# Altium project S88N_Occupancy_Detector.PrjPcb
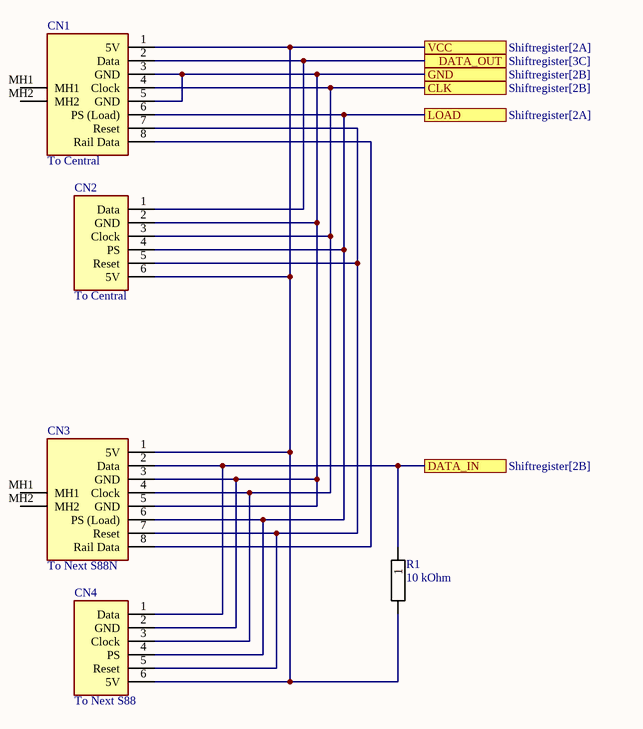
[diagram p0: Databus.SchDoc]
6 sheets, 55 parts. Net scope: flat (ports and power ports of the same name join across sheets).
Board files: S88N_Occupancy_Detector.PcbDoc, S88N_Occupancy_Detector_Rev_2.PcbDoc
Sheets:
  Databus.SchDoc
  Shiftregister.SchDoc
  Inverter.SchDoc
  Current_Detection_Connectors.SchDoc
  Current_Detection_1_8.SchDoc
  Current_Detection_9_16.SchDoc

## Sheet Databus.SchDoc: S88-N Occupancy Detector
size A4; DrawnBy: Sem Kirkels; DocumentNumber: 23P001S01; Revision: V1; SheetNumber: 1; SheetTotal: 6

### Parts
CN1  To Central  [RJ45_Connector]
CN2  To Central  [6 pin header]
CN3  To Next S88N  [RJ45_Connector]
CN4  To Next S88  [6 pin header]
R1  10 kOhm  [1N4007]

### Ports
CLK (see Shiftregister[2B]), DATA_IN (see Shiftregister[2B]), DATA_OUT (see Shiftregister[3C]), GND (see Shiftregister[2B]), LOAD (see Shiftregister[2A]), VCC (see Shiftregister[2A])

### Nets
GND: CN1.3(GND) CN1.5(GND) CN2.2(GND) CN3.3(GND) CN3.5(GND) CN4.2(GND) ; port GND
VCC: CN1.1(5V) CN2.6(5V) CN3.1(5V) CN4.6(5V) R1.2 ; port VCC
NetCN1_2: CN1.2(Data) CN2.1(Data) ; port DATA_OUT
NetCN1_4: CN1.4(Clock) CN2.3(Clock) CN3.4(Clock) CN4.3(Clock) ; port CLK
NetCN1_6: CN1.6(PS_(Load)) CN2.4(PS) CN3.6(PS_(Load)) CN4.4(PS) ; port LOAD
NetCN1_7: CN1.7(Reset) CN2.5(Reset) CN3.7(Reset) CN4.5(Reset)
NetCN1_8: CN1.8(Rail_Data) CN3.8(Rail_Data)
NetCN3_2: CN3.2(Data) CN4.1(Data) R1.1 ; port DATA_IN

Not connected (* = marked no-connect by the designer): CN1 MH1 MH2; CN3 MH1 MH2

### Library data of the parts
CN1 CN3 = RJ45_Connector: Connector; Manufacturer_Name: Weidmuller; Manufacturer_Part_Number: 2562910000; Datasheet Link: https://catalog.weidmueller.com/catalog/Start.do?localeId=en&ObjectID=2562910000; Height: 13.76mm; Mouser Part Number: 470-2562910000; Mouser Price/Stock: https://www.mouser.co.uk/ProductDetail/Weidmuller/2562910000?qs=w%2Fv1CP2dgqr4xNEXLArdDQ%3D%3D
CN2 CN4 = 6 pin header: 78511-406; Manufacturer_Name: Amphenol Communication Solutions; Datasheet Link: https://cdn.amphenol-cs.com/media/wysiwyg/files/drawing/68000.pdf; Height: 10.62mm; Manufacturer_Part_Number: 78511-406; Mouser Part Number: 649-78511-406; Mouser Price/Stock: https://www.mouser.co.uk/ProductDetail/Amphenol-FCI/78511-406?qs=44C8ns5dLY9MkbPan6dMVA%3D%3D; Arrow Part Number: 78511-406; Arrow Price/Stock: https://www.arrow.com/en/products/78511-406/amphenol-fci
R1 = Resistor: NexarPartId: 43026420; Power Rating: 3W; Tolerance: 5%; Temperature Coefficient: -10ppm/°C; Resistance: 8.2Ω; Thickness: 4.8006mm; Radiation Hardening: No; Min Operating Temperature: -40°C; Case/Package: Axial; Packaging: Tape & Box (TB); Termination: Axial; Width: 4.8006mm; Military Standard: Not; Diameter: 4.8mm; RoHS: Compliant; Contact Plating: Tin; Composition: Wirewound; Features: Flame Retardant Coating; Number of Terminations: 2; Length: 13mm; Max Power Dissipation: 3W; Mount: Through Hole; Max Operating Temperature: 200°C

## Sheet Shiftregister.SchDoc: S88-N Occupancy Detector
size A4; DrawnBy: Sem Kirkels; DocumentNumber: 23P001S02; Revision: V1; SheetNumber: 2; SheetTotal: 6
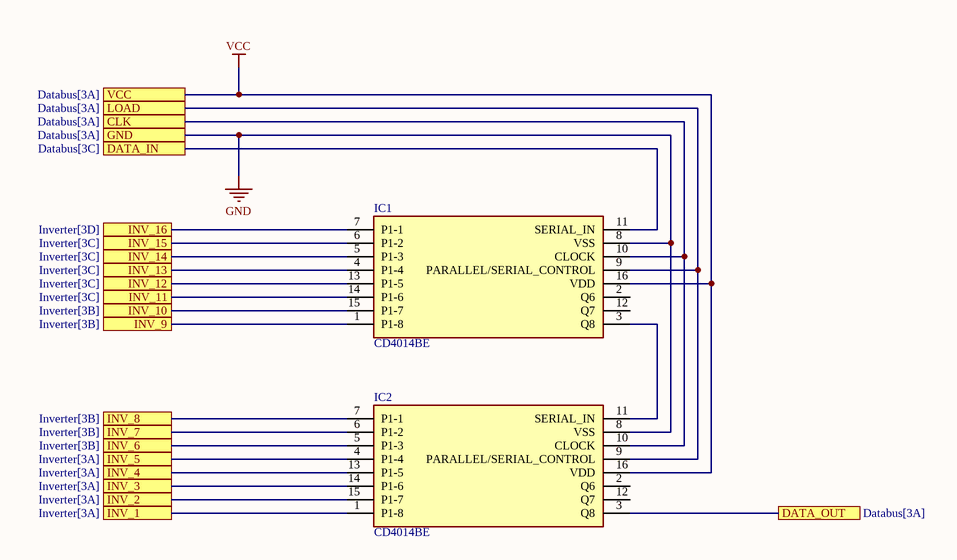
[diagram p1: Shiftregister.SchDoc]

### Parts
IC1  CD4014BE  [CD4014]
IC2  CD4014BE  [CD4014]

### Ports
CLK (see Databus[3A]), DATA_IN (see Databus[3C]), DATA_OUT (see Databus[3A]), GND (see Databus[3A]), INV_1 (see Inverter[3A]), INV_2 (see Inverter[3A]), INV_3 (see Inverter[3A]), INV_4 (see Inverter[3A]), INV_5 (see Inverter[3A]), INV_6 (see Inverter[3B]), INV_7 (see Inverter[3B]), INV_8 (see Inverter[3B]), INV_9 (see Inverter[3B]), INV_10 (see Inverter[3B]), INV_11 (see Inverter[3C]), INV_12 (see Inverter[3C]), INV_13 (see Inverter[3C]), INV_14 (see Inverter[3C]), INV_15 (see Inverter[3C]), INV_16 (see Inverter[3D]), LOAD (see Databus[3A]), VCC (see Databus[3A])

### Nets
GND: IC1.8(VSS) IC2.8(VSS) ; port GND
VCC: IC1.16(VDD) IC2.16(VDD) ; port VCC
NetCN1_2: IC2.3(Q8) ; port DATA_OUT
NetCN1_4: IC1.10(CLOCK) IC2.10(CLOCK) ; port CLK
NetCN1_6: IC1.9(PARALLEL/SERIAL_CONTROL) IC2.9(PARALLEL/SERIAL_CONTROL) ; port LOAD
NetCN3_2: IC1.11(SERIAL_IN) ; port DATA_IN
NetIC1_1: IC1.1(P1-8) ; port INV_9
NetIC1_3: IC1.3(Q8) IC2.11(SERIAL_IN)
NetIC1_4: IC1.4(P1-4) ; port INV_13
NetIC1_5: IC1.5(P1-3) ; port INV_14
NetIC1_6: IC1.6(P1-2) ; port INV_15
NetIC1_7: IC1.7(P1-1) ; port INV_16
NetIC1_13: IC1.13(P1-5) ; port INV_12
NetIC1_14: IC1.14(P1-6) ; port INV_11
NetIC1_15: IC1.15(P1-7) ; port INV_10
NetIC2_1: IC2.1(P1-8) ; port INV_1
NetIC2_4: IC2.4(P1-4) ; port INV_5
NetIC2_5: IC2.5(P1-3) ; port INV_6
NetIC2_6: IC2.6(P1-2) ; port INV_7
NetIC2_7: IC2.7(P1-1) ; port INV_8
NetIC2_13: IC2.13(P1-5) ; port INV_4
NetIC2_14: IC2.14(P1-6) ; port INV_3
NetIC2_15: IC2.15(P1-7) ; port INV_2

Not connected (* = marked no-connect by the designer): IC1 2(Q6) 12(Q7); IC2 2(Q6) 12(Q7)

### Library data of the parts
IC1 IC2 = CD4014BE: Integrated Circuit; Manufacturer_Name: Texas Instruments; Datasheet Link: http://www.ti.com/lit/gpn/cd4014b; Height: 5.08mm; Manufacturer_Part_Number: CD4014BE; Mouser Part Number: 595-CD4014BE; Mouser Price/Stock: https://www.mouser.co.uk/ProductDetail/Texas-Instruments/CD4014BE?qs=8k%2FZSzWMuCOtKecuorM4CQ%3D%3D; Arrow Part Number: CD4014BE; Arrow Price/Stock: https://www.arrow.com/en/products/cd4014be/texas-instruments?region=nac

## Sheet Inverter.SchDoc: S88-N Occupancy Detector
size A4; DrawnBy: Sem Kirkels; DocumentNumber: 23P001S03; Revision: V2; SheetNumber: 3; SheetTotal: 6
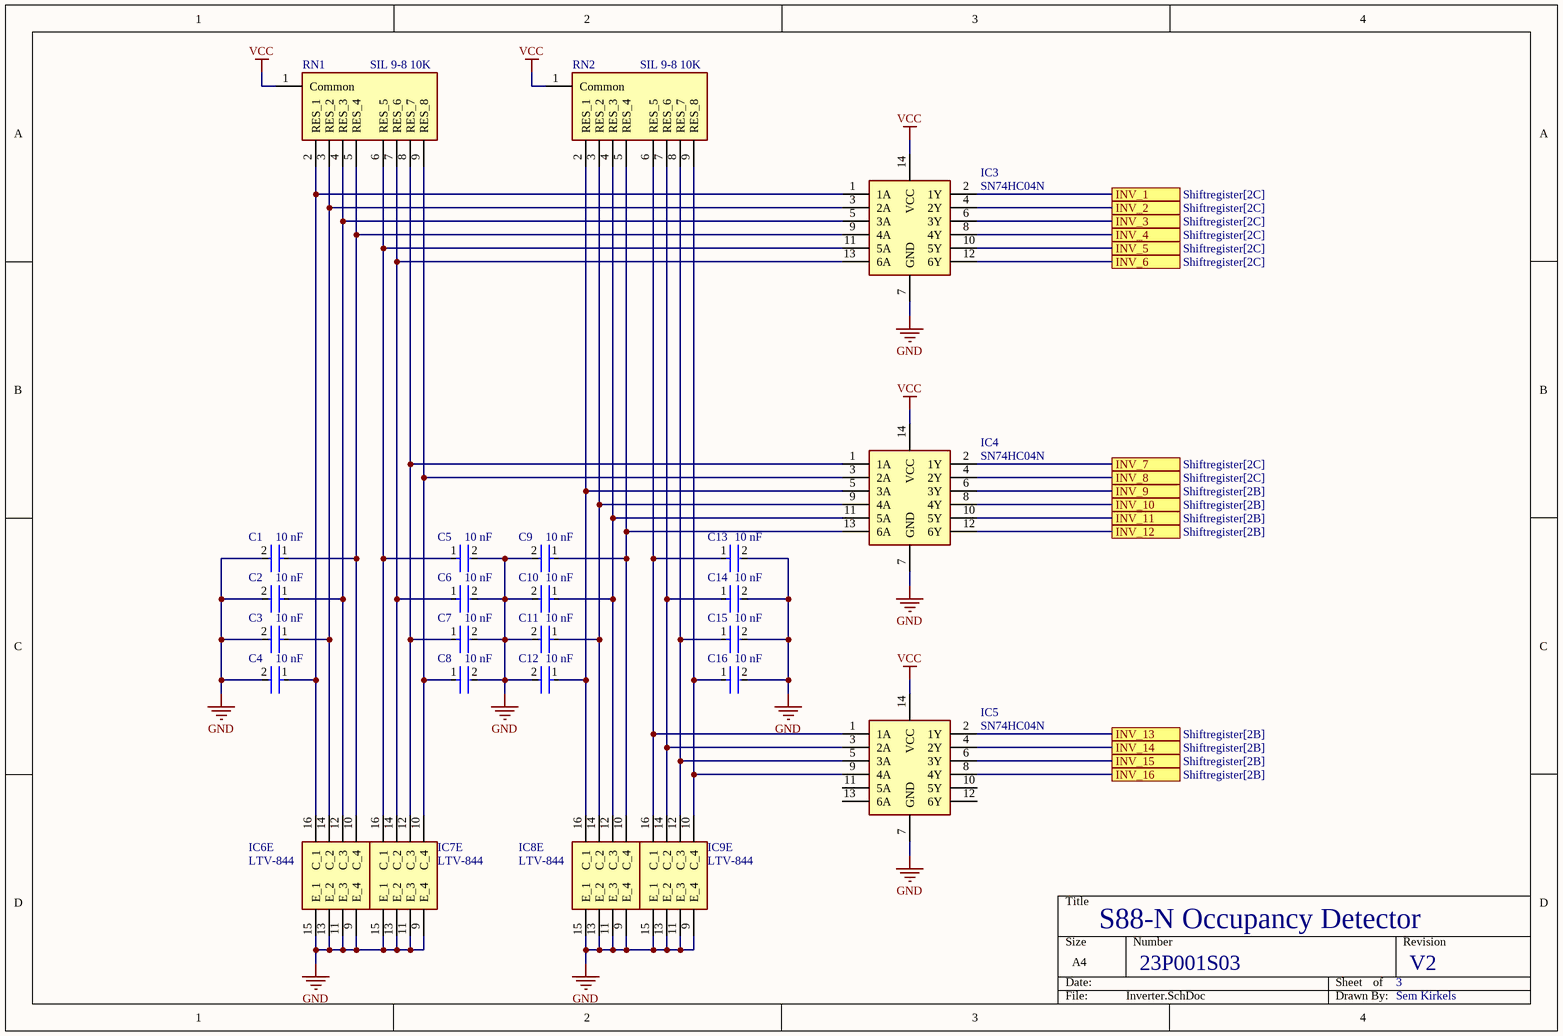
[diagram p2: Inverter.SchDoc]

### Parts
C1  10 nF  [Capacitor]
C2  10 nF  [Capacitor]
C3  10 nF  [Capacitor]
C4  10 nF  [Capacitor]
C5  10 nF  [Capacitor]
C6  10 nF  [Capacitor]
C7  10 nF  [Capacitor]
C8  10 nF  [Capacitor]
C9  10 nF  [Capacitor]
C10  10 nF  [Capacitor]
C11  10 nF  [Capacitor]
C12  10 nF  [Capacitor]
C13  10 nF  [Capacitor]
C14  10 nF  [Capacitor]
C15  10 nF  [Capacitor]
C16  10 nF  [Capacitor]
IC3  SN74HC04N  [SN74HC04]
IC4  SN74HC04N  [SN74HC04]
IC5  SN74HC04N  [SN74HC04]
IC6  LTV-844  [CD4014]  (part E of 5)
IC7  LTV-844  [CD4014]  (part E of 5)
IC8  LTV-844  [CD4014]  (part E of 5)
IC9  LTV-844  [CD4014]  (part E of 5)
RN1  SIL 9-8 10K  [SIL 9-8 10K]
RN2  SIL 9-8 10K  [SIL 9-8 10K]

### Ports
INV_1 (see Shiftregister[2C]), INV_2 (see Shiftregister[2C]), INV_3 (see Shiftregister[2C]), INV_4 (see Shiftregister[2C]), INV_5 (see Shiftregister[2C]), INV_6 (see Shiftregister[2C]), INV_7 (see Shiftregister[2C]), INV_8 (see Shiftregister[2C]), INV_9 (see Shiftregister[2B]), INV_10 (see Shiftregister[2B]), INV_11 (see Shiftregister[2B]), INV_12 (see Shiftregister[2B]), INV_13 (see Shiftregister[2B]), INV_14 (see Shiftregister[2B]), INV_15 (see Shiftregister[2B]), INV_16 (see Shiftregister[2B])

### Nets
GND: C1.2 C2.2 C3.2 C4.2 C5.2 C6.2 C7.2 C8.2 C9.2 C10.2 C11.2 C12.2 C13.2 C14.2 C15.2 C16.2 IC3.7(GND) IC4.7(GND) IC5.7(GND) IC6.9(E_4) IC6.11(E_3) IC6.13(E_2) IC6.15(E_1) IC7.9(E_4) IC7.11(E_3) IC7.13(E_2) IC7.15(E_1) IC8.9(E_4) IC8.11(E_3) IC8.13(E_2) IC8.15(E_1) IC9.9(E_4) IC9.11(E_3) IC9.13(E_2) IC9.15(E_1)
VCC: IC3.14(VCC) IC4.14(VCC) IC5.14(VCC) RN1.1(Common) RN2.1(Common)
NetC1_1: C1.1 IC3.9(4A) IC6.10(C_4) RN1.5(RES_4)
NetC2_1: C2.1 IC3.5(3A) IC6.12(C_3) RN1.4(RES_3)
NetC3_1: C3.1 IC3.3(2A) IC6.14(C_2) RN1.3(RES_2)
NetC4_1: C4.1 IC3.1(1A) IC6.16(C_1) RN1.2(RES_1)
NetC5_1: C5.1 IC3.11(5A) IC7.16(C_1) RN1.6(RES_5)
NetC6_1: C6.1 IC3.13(6A) IC7.14(C_2) RN1.7(RES_6)
NetC7_1: C7.1 IC4.1(1A) IC7.12(C_3) RN1.8(RES_7)
NetC8_1: C8.1 IC4.3(2A) IC7.10(C_4) RN1.9(RES_8)
NetC9_1: C9.1 IC4.13(6A) IC8.10(C_4) RN2.5(RES_4)
NetC10_1: C10.1 IC4.11(5A) IC8.12(C_3) RN2.4(RES_3)
NetC11_1: C11.1 IC4.9(4A) IC8.14(C_2) RN2.3(RES_2)
NetC12_1: C12.1 IC4.5(3A) IC8.16(C_1) RN2.2(RES_1)
NetC13_1: C13.1 IC5.1(1A) IC9.16(C_1) RN2.6(RES_5)
NetC14_1: C14.1 IC5.3(2A) IC9.14(C_2) RN2.7(RES_6)
NetC15_1: C15.1 IC5.5(3A) IC9.12(C_3) RN2.8(RES_7)
NetC16_1: C16.1 IC5.9(4A) IC9.10(C_4) RN2.9(RES_8)
NetIC1_1: IC4.6(3Y) ; port INV_9
NetIC1_4: IC5.2(1Y) ; port INV_13
NetIC1_5: IC5.4(2Y) ; port INV_14
NetIC1_6: IC5.6(3Y) ; port INV_15
NetIC1_7: IC5.8(4Y) ; port INV_16
NetIC1_13: IC4.12(6Y) ; port INV_12
NetIC1_14: IC4.10(5Y) ; port INV_11
NetIC1_15: IC4.8(4Y) ; port INV_10
NetIC2_1: IC3.2(1Y) ; port INV_1
NetIC2_4: IC3.10(5Y) ; port INV_5
NetIC2_5: IC3.12(6Y) ; port INV_6
NetIC2_6: IC4.2(1Y) ; port INV_7
NetIC2_7: IC4.4(2Y) ; port INV_8
NetIC2_13: IC3.8(4Y) ; port INV_4
NetIC2_14: IC3.6(3Y) ; port INV_3
NetIC2_15: IC3.4(2Y) ; port INV_2

Not connected (* = marked no-connect by the designer): IC5 10(5Y) 11(5A) 12(6Y) 13(6A)

### Library data of the parts
C1-C16 = Capacitor: Voltage Rating (AC): 500V; Lead Diameter: 0.6mm; Capacitance: 4.7nF; Tolerance: 20%; Lead/Base Style: Kinked; Dielectric: Y5U; Termination: Radial; Resistor Type: Ceramic; Radiation Hardening: No; Diameter: 16mm; Max Operating Temperature: 125°C; Case/Package: Radial; Thickness: 5mm; Lead Pitch: 10mm; Series: VY1; Contact Plating: Tin; Depth: 5mm; RoHS Compliant: Yes; Voltage: 500V; Voltage Rating (DC): 500V; Package Quantity: 500; Construction: RADIAL; Min Operating Temperature: -40°C; Height: 19mm; Height - Seated (Max): 0.787inch; Packaging: Tape and Reel; Mount: Through Hole
IC3-IC5 = SN74HC04N: Integrated Circuit; Manufacturer_Name: Texas Instruments; Datasheet Link: http://www.ti.com/lit/gpn/sn74hc04; Height: 5.08mm; Manufacturer_Part_Number: SN74HC04N; Mouser Part Number: 595-SN74HC04N; Mouser Price/Stock: https://www.mouser.co.uk/ProductDetail/Texas-Instruments/SN74HC04N?qs=L5CvrNUdZirrSGYiJvTylA%3D%3D; Arrow Part Number: SN74HC04N; Arrow Price/Stock: https://www.arrow.com/en/products/sn74hc04n/texas-instruments?region=nac
IC6-IC9 = LTV-844: Integrated Circuit; Manufacturer_Name: Lite-On; Datasheet Link: https://componentsearchengine.com/Datasheets/1/LTV-844.pdf; Height: 4.5mm; Manufacturer_Part_Number: LTV-844; Mouser Part Number: 859-LTV-844; Mouser Price/Stock: https://www.mouser.co.uk/ProductDetail/Lite-On/LTV-844?qs=BZ0sscl82p8P4kyBjSwzAg%3D%3D; Arrow Part Number: LTV-844; Arrow Price/Stock: https://www.arrow.com/en/products/ltv-844/lite-on-technology?region=nac
RN1 RN2 = SIL 9-8 10K: CSC09A0110K0GEK; Manufacturer_Name: Vishay; Datasheet Link: https://www.vishay.com/docs/31509/csc.pdf; Height: 4.95mm; Manufacturer_Part_Number: CSC09A0110K0GEK; Mouser Part Number: 71-CSC09A0110K0GEK; Mouser Price/Stock: https://www.mouser.co.uk/ProductDetail/Vishay-Dale/CSC09A0110K0GEK?qs=Jzz%252BfO4IBMfusae2i1IhQQ%3D%3D; Arrow Part Number: CSC09A0110K0GEK; Arrow Price/Stock: https://www.arrow.com/en/products/csc09a0110k0gek/vishay

## Sheet Current_Detection_Connectors.SchDoc: S88-N Occupancy Detector
size A4; DrawnBy: Sem Kirkels; DocumentNumber: 23P001S04; Revision: V1; SheetNumber: 4; SheetTotal: 6
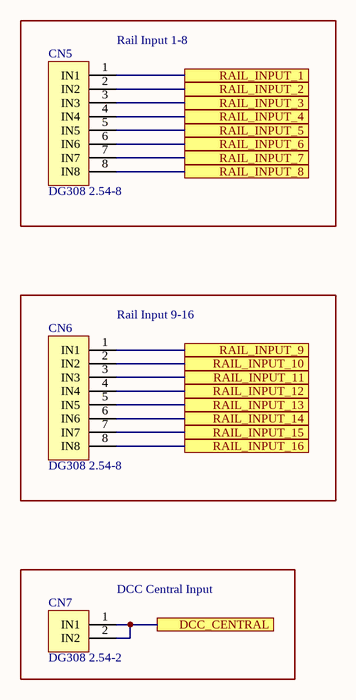
[diagram p3: Current_Detection_Connectors.SchDoc]

### Parts
CN5  DG308 2.54-8  [DG308 2.54-8]
CN6  DG308 2.54-8  [DG308 2.54-8]
CN7  DG308 2.54-2  [DG308 2.54-2]

### Blocks framed on the sheet
Rail Input 1-8: CN5
Rail Input 9-16: CN6
DCC Central Input: CN7

### Ports
DCC_CENTRAL (see Current_Detection_1_8[2A], Current_Detection_1_8[2B], Current_Detection_1_8[2C], Current_Detection_1_8[4A], Current_Detection_1_8[4B], Current_Detection_1_8[4C], Current_Detection_9_16[2A], Current_Detection_9_16[2B], Current_Detection_9_16[2C], Current_Detection_9_16[4A], Current_Detection_9_16[4B], Current_Detection_9_16[4C]), RAIL_INPUT_1 (see Current_Detection_1_8[1A]), RAIL_INPUT_2 (see Current_Detection_1_8[3A]), RAIL_INPUT_3 (see Current_Detection_1_8[1B]), RAIL_INPUT_4 (see Current_Detection_1_8[3B]), RAIL_INPUT_5 (see Current_Detection_1_8[1B]), RAIL_INPUT_6 (see Current_Detection_1_8[3B]), RAIL_INPUT_7 (see Current_Detection_1_8[1C]), RAIL_INPUT_8 (see Current_Detection_1_8[3C]), RAIL_INPUT_9 (see Current_Detection_9_16[1A]), RAIL_INPUT_10 (see Current_Detection_9_16[3A]), RAIL_INPUT_11 (see Current_Detection_9_16[1B]), RAIL_INPUT_12 (see Current_Detection_9_16[3B]), RAIL_INPUT_13 (see Current_Detection_9_16[1B]), RAIL_INPUT_14 (see Current_Detection_9_16[3B]), RAIL_INPUT_15 (see Current_Detection_9_16[1C]), RAIL_INPUT_16 (see Current_Detection_9_16[3C])

### Nets
NetCN5_1: CN5.1(IN1) ; port RAIL_INPUT_1
NetCN5_2: CN5.2(IN2) ; port RAIL_INPUT_2
NetCN5_3: CN5.3(IN3) ; port RAIL_INPUT_3
NetCN5_4: CN5.4(IN4) ; port RAIL_INPUT_4
NetCN5_5: CN5.5(IN5) ; port RAIL_INPUT_5
NetCN5_6: CN5.6(IN6) ; port RAIL_INPUT_6
NetCN5_7: CN5.7(IN7) ; port RAIL_INPUT_7
NetCN5_8: CN5.8(IN8) ; port RAIL_INPUT_8
NetCN6_1: CN6.1(IN1) ; port RAIL_INPUT_9
NetCN6_2: CN6.2(IN2) ; port RAIL_INPUT_10
NetCN6_3: CN6.3(IN3) ; port RAIL_INPUT_11
NetCN6_4: CN6.4(IN4) ; port RAIL_INPUT_12
NetCN6_5: CN6.5(IN5) ; port RAIL_INPUT_13
NetCN6_6: CN6.6(IN6) ; port RAIL_INPUT_14
NetCN6_7: CN6.7(IN7) ; port RAIL_INPUT_15
NetCN6_8: CN6.8(IN8) ; port RAIL_INPUT_16
NetCN7_1: CN7.1(IN1) CN7.2(IN2) ; port DCC_CENTRAL

### Library data of the parts
CN5 CN6 = 8_Pin_Screw_Connector
CN7 = 2_Pin_Screw_Connector

## Sheet Current_Detection_1_8.SchDoc: S88-N Occupancy Detector
size A4; DrawnBy: Sem Kirkels; DocumentNumber: 23P001S05; Revision: V1; SheetNumber: 5; SheetTotal: 6
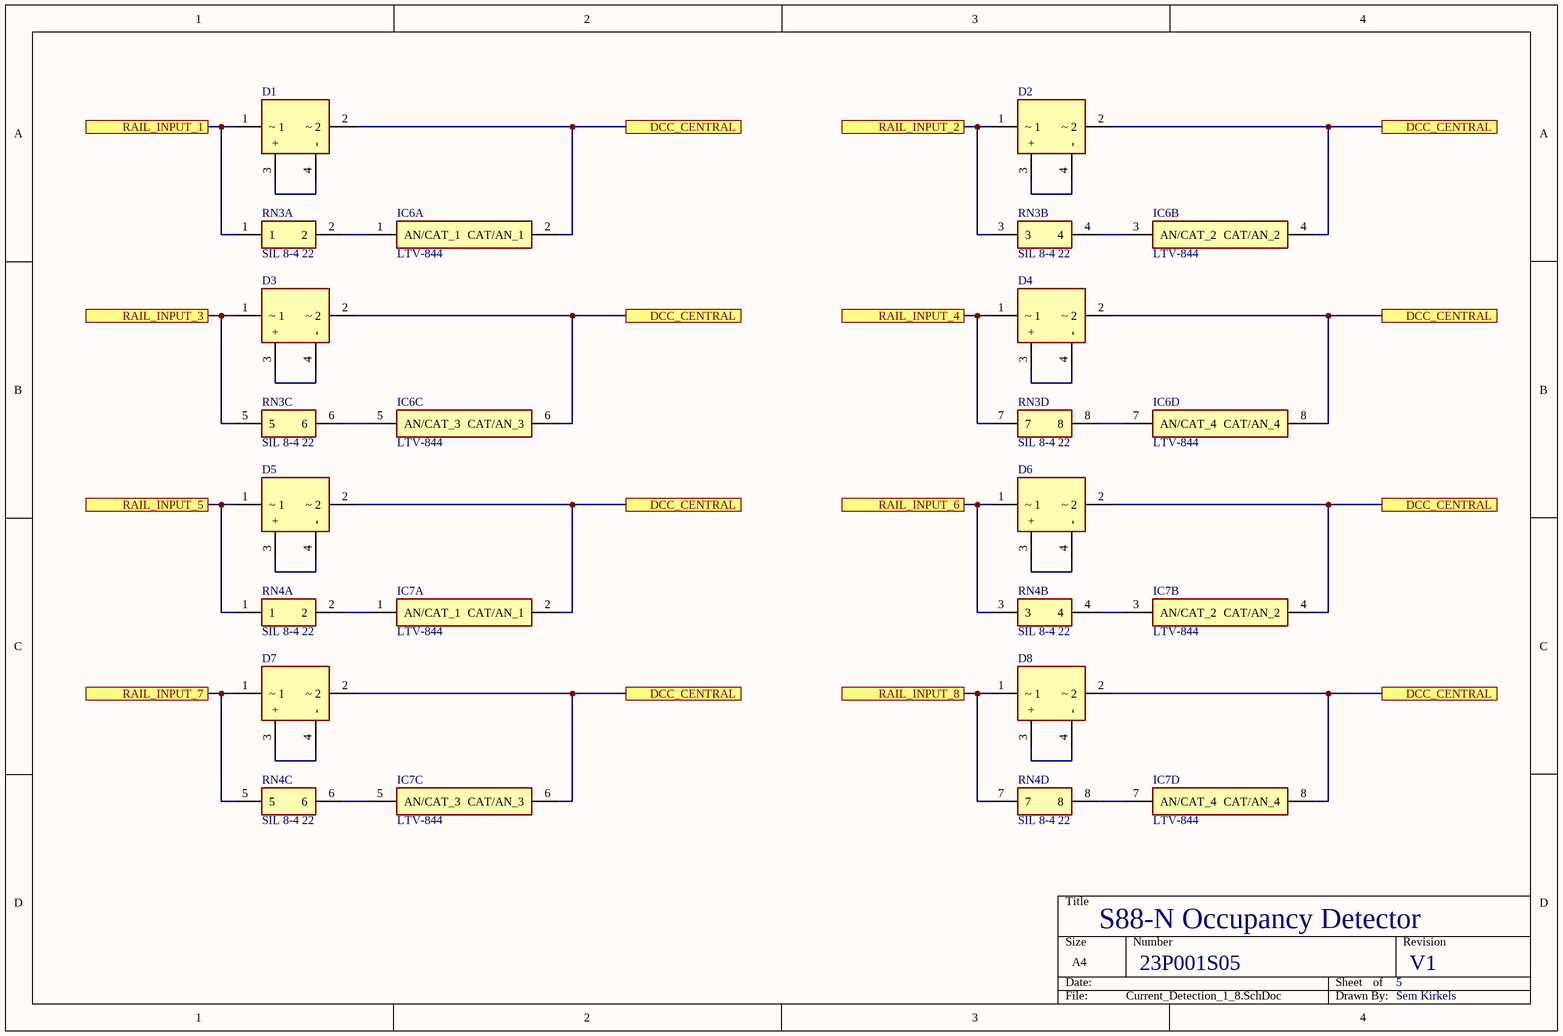
[diagram p4: Current_Detection_1_8.SchDoc]

### Parts
D1  B140C1000DIP_DB101  [FBR_B140C1000DIP]  (value not drawn)
D2  B140C1000DIP_DB101  [FBR_B140C1000DIP]  (value not drawn)
D3  B140C1000DIP_DB101  [FBR_B140C1000DIP]  (value not drawn)
D4  B140C1000DIP_DB101  [FBR_B140C1000DIP]  (value not drawn)
D5  B140C1000DIP_DB101  [FBR_B140C1000DIP]  (value not drawn)
D6  B140C1000DIP_DB101  [FBR_B140C1000DIP]  (value not drawn)
D7  B140C1000DIP_DB101  [FBR_B140C1000DIP]  (value not drawn)
D8  B140C1000DIP_DB101  [FBR_B140C1000DIP]  (value not drawn)
IC6  LTV-844  [CD4014]  (parts A,B,C,D of 5)
IC7  LTV-844  [CD4014]  (parts A,B,C,D of 5)
RN3  SIL 8-4 22  [SIL 8-4]  (parts A,B,C,D of 4)
RN4  SIL 8-4 22  [SIL 8-4]  (parts A,B,C,D of 4)

### Ports
DCC_CENTRAL (see Current_Detection_1_8[2A], Current_Detection_1_8[2B], Current_Detection_1_8[2C], Current_Detection_1_8[4A], Current_Detection_1_8[4B], Current_Detection_1_8[4C], Current_Detection_9_16[2A], Current_Detection_9_16[2B], Current_Detection_9_16[2C], Current_Detection_9_16[4A], Current_Detection_9_16[4B], Current_Detection_9_16[4C], Current_Detection_Connectors[3C]), DCC_CENTRAL (see Current_Detection_1_8[2A], Current_Detection_1_8[2B], Current_Detection_1_8[2C], Current_Detection_1_8[4A], Current_Detection_1_8[4B], Current_Detection_9_16[2A], Current_Detection_9_16[2B], Current_Detection_9_16[2C], Current_Detection_9_16[4A], Current_Detection_9_16[4B], Current_Detection_9_16[4C], Current_Detection_Connectors[3C]), DCC_CENTRAL (see Current_Detection_1_8[2A], Current_Detection_1_8[2B], Current_Detection_1_8[2C], Current_Detection_1_8[4B], Current_Detection_1_8[4C], Current_Detection_9_16[2A], Current_Detection_9_16[2B], Current_Detection_9_16[2C], Current_Detection_9_16[4A], Current_Detection_9_16[4B], Current_Detection_9_16[4C], Current_Detection_Connectors[3C]), DCC_CENTRAL (see Current_Detection_1_8[2A], Current_Detection_1_8[2B], Current_Detection_1_8[4A], Current_Detection_1_8[4B], Current_Detection_1_8[4C], Current_Detection_9_16[2A], Current_Detection_9_16[2B], Current_Detection_9_16[2C], Current_Detection_9_16[4A], Current_Detection_9_16[4B], Current_Detection_9_16[4C], Current_Detection_Connectors[3C]), DCC_CENTRAL (see Current_Detection_1_8[2B], Current_Detection_1_8[2C], Current_Detection_1_8[4A], Current_Detection_1_8[4B], Current_Detection_1_8[4C], Current_Detection_9_16[2A], Current_Detection_9_16[2B], Current_Detection_9_16[2C], Current_Detection_9_16[4A], Current_Detection_9_16[4B], Current_Detection_9_16[4C], Current_Detection_Connectors[3C]), RAIL_INPUT_1 (see Current_Detection_Connectors[3A]), RAIL_INPUT_2 (see Current_Detection_Connectors[3A]), RAIL_INPUT_3 (see Current_Detection_Connectors[3A]), RAIL_INPUT_4 (see Current_Detection_Connectors[3A]), RAIL_INPUT_5 (see Current_Detection_Connectors[3A]), RAIL_INPUT_6 (see Current_Detection_Connectors[3A]), RAIL_INPUT_7 (see Current_Detection_Connectors[3A]), RAIL_INPUT_8 (see Current_Detection_Connectors[3A])

### Nets
NetCN5_1: D1.1(~_1) RN3.1 ; port RAIL_INPUT_1
NetCN5_2: D2.1(~_1) RN3.3 ; port RAIL_INPUT_2
NetCN5_3: D3.1(~_1) RN3.5 ; port RAIL_INPUT_3
NetCN5_4: D4.1(~_1) RN3.7 ; port RAIL_INPUT_4
NetCN5_5: D5.1(~_1) RN4.1 ; port RAIL_INPUT_5
NetCN5_6: D6.1(~_1) RN4.3 ; port RAIL_INPUT_6
NetCN5_7: D7.1(~_1) RN4.5 ; port RAIL_INPUT_7
NetCN5_8: D8.1(~_1) RN4.7 ; port RAIL_INPUT_8
NetCN7_1: D1.2(~_2) D2.2(~_2) D3.2(~_2) D4.2(~_2) D5.2(~_2) D6.2(~_2) D7.2(~_2) D8.2(~_2) IC6.2(CAT/AN_1) IC6.4(CAT/AN_2) IC6.6(CAT/AN_3) IC6.8(CAT/AN_4) IC7.2(CAT/AN_1) IC7.4(CAT/AN_2) IC7.6(CAT/AN_3) IC7.8(CAT/AN_4) ; port DCC_CENTRAL
NetD1_3: D1.3(+) D1.4(-)
NetD2_3: D2.3(+) D2.4(-)
NetD3_3: D3.3(+) D3.4(-)
NetD4_3: D4.3(+) D4.4(-)
NetD5_3: D5.3(+) D5.4(-)
NetD6_3: D6.3(+) D6.4(-)
NetD7_3: D7.3(+) D7.4(-)
NetD8_3: D8.3(+) D8.4(-)
NetIC6_1: IC6.1(AN/CAT_1) RN3.2
NetIC6_3: IC6.3(AN/CAT_2) RN3.4
NetIC6_5: IC6.5(AN/CAT_3) RN3.6
NetIC6_7: IC6.7(AN/CAT_4) RN3.8
NetIC7_1: IC7.1(AN/CAT_1) RN4.2
NetIC7_3: IC7.3(AN/CAT_2) RN4.4
NetIC7_5: IC7.5(AN/CAT_3) RN4.6
NetIC7_7: IC7.7(AN/CAT_4) RN4.8

### Library data of the parts
D1-D8 = B140C1000DIP_DB101: Bridge Rectifier; Manufacturer_Name: Rectron; Manufacturer_Part_Number: DB101; Datasheet Link: http://www.rectron.com/data_sheets/db101-107.pdf; Height: 4.9mm; Mouser Part Number: 583-DB101; Mouser Price/Stock: https://www.mouser.co.uk/ProductDetail/Rectron/DB101?qs=G5AQjGfRJcKGSaxDP6qXzQ%3D%3D
IC6 IC7 = LTV-844: as IC6 on sheet Inverter; Datasheet Link: https://componentsearchengine.com/Datasheets/1/LTV-844.pdf; Height: 4.5mm; Manufacturer_Part_Number: LTV-844; Mouser Part Number: 859-LTV-844; Mouser Price/Stock: https://www.mouser.co.uk/ProductDetail/Lite-On/LTV-844?qs=BZ0sscl82p8P4kyBjSwzAg%3D%3D; Arrow Part Number: LTV-844; Arrow Price/Stock: https://www.arrow.com/en/products/ltv-844/lite-on-technology?region=nac
RN3 RN4 = SIL 8-4 22: Resistor Network; Manufacturer_Name: Bourns; Manufacturer_Part_Number: 4608X-102-102LF; Datasheet Link: http://www.bourns.com/pdfs/4600X.pdf; Height: 5.08mm; Mouser Part Number: 652-4608X-2LF-1K; Mouser Price/Stock: https://www.mouser.co.uk/ProductDetail/Bourns/4608X-102-102LF?qs=EFWIAreJVABaVln%252BuPVHjA%3D%3D; Arrow Part Number: 4608X-102-102LF; Arrow Price/Stock: https://www.arrow.com/en/products/4608x-102-102lf/bourns?region=europe

## Sheet Current_Detection_9_16.SchDoc: S88-N Occupancy Detector
size A4; DrawnBy: Sem Kirkels; DocumentNumber: 23P001S06; Revision: V1; SheetNumber: 6; SheetTotal: 6
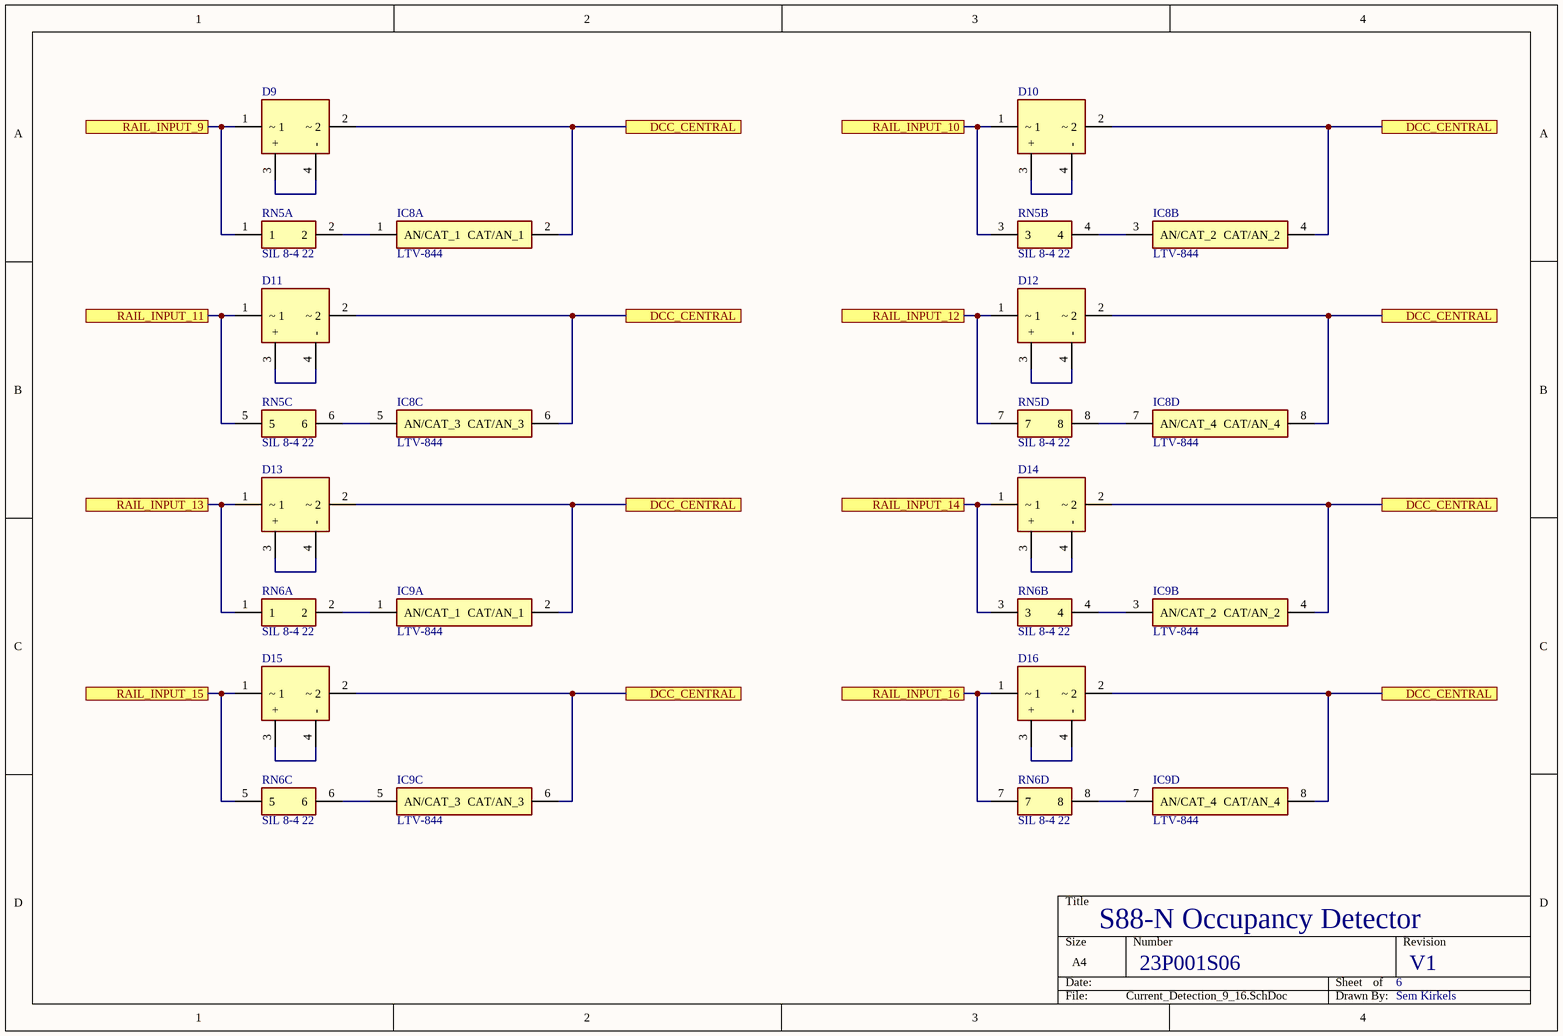
[diagram p5: Current_Detection_9_16.SchDoc]

### Parts
D9  B140C1000DIP_DB101  [FBR_B140C1000DIP]  (value not drawn)
D10  B140C1000DIP_DB101  [FBR_B140C1000DIP]  (value not drawn)
D11  B140C1000DIP_DB101  [FBR_B140C1000DIP]  (value not drawn)
D12  B140C1000DIP_DB101  [FBR_B140C1000DIP]  (value not drawn)
D13  B140C1000DIP_DB101  [FBR_B140C1000DIP]  (value not drawn)
D14  B140C1000DIP_DB101  [FBR_B140C1000DIP]  (value not drawn)
D15  B140C1000DIP_DB101  [FBR_B140C1000DIP]  (value not drawn)
D16  B140C1000DIP_DB101  [FBR_B140C1000DIP]  (value not drawn)
IC8  LTV-844  [CD4014]  (parts A,B,C,D of 5)
IC9  LTV-844  [CD4014]  (parts A,B,C,D of 5)
RN5  SIL 8-4 22  [SIL 8-4]  (parts A,B,C,D of 4)
RN6  SIL 8-4 22  [SIL 8-4]  (parts A,B,C,D of 4)

### Ports
DCC_CENTRAL (see Current_Detection_1_8[2A], Current_Detection_1_8[2B], Current_Detection_1_8[2C], Current_Detection_1_8[4A], Current_Detection_1_8[4B], Current_Detection_1_8[4C], Current_Detection_9_16[2A], Current_Detection_9_16[2B], Current_Detection_9_16[2C], Current_Detection_9_16[4A], Current_Detection_9_16[4B], Current_Detection_9_16[4C], Current_Detection_Connectors[3C]), DCC_CENTRAL (see Current_Detection_1_8[2A], Current_Detection_1_8[2B], Current_Detection_1_8[2C], Current_Detection_1_8[4A], Current_Detection_1_8[4B], Current_Detection_1_8[4C], Current_Detection_9_16[2A], Current_Detection_9_16[2B], Current_Detection_9_16[2C], Current_Detection_9_16[4A], Current_Detection_9_16[4B], Current_Detection_Connectors[3C]), DCC_CENTRAL (see Current_Detection_1_8[2A], Current_Detection_1_8[2B], Current_Detection_1_8[2C], Current_Detection_1_8[4A], Current_Detection_1_8[4B], Current_Detection_1_8[4C], Current_Detection_9_16[2A], Current_Detection_9_16[2B], Current_Detection_9_16[2C], Current_Detection_9_16[4B], Current_Detection_9_16[4C], Current_Detection_Connectors[3C]), DCC_CENTRAL (see Current_Detection_1_8[2A], Current_Detection_1_8[2B], Current_Detection_1_8[2C], Current_Detection_1_8[4A], Current_Detection_1_8[4B], Current_Detection_1_8[4C], Current_Detection_9_16[2A], Current_Detection_9_16[2B], Current_Detection_9_16[4A], Current_Detection_9_16[4B], Current_Detection_9_16[4C], Current_Detection_Connectors[3C]), DCC_CENTRAL (see Current_Detection_1_8[2A], Current_Detection_1_8[2B], Current_Detection_1_8[2C], Current_Detection_1_8[4A], Current_Detection_1_8[4B], Current_Detection_1_8[4C], Current_Detection_9_16[2B], Current_Detection_9_16[2C], Current_Detection_9_16[4A], Current_Detection_9_16[4B], Current_Detection_9_16[4C], Current_Detection_Connectors[3C]), RAIL_INPUT_9 (see Current_Detection_Connectors[3B]), RAIL_INPUT_10 (see Current_Detection_Connectors[3B]), RAIL_INPUT_11 (see Current_Detection_Connectors[3B]), RAIL_INPUT_12 (see Current_Detection_Connectors[3B]), RAIL_INPUT_13 (see Current_Detection_Connectors[3B]), RAIL_INPUT_14 (see Current_Detection_Connectors[3B]), RAIL_INPUT_15 (see Current_Detection_Connectors[3B]), RAIL_INPUT_16 (see Current_Detection_Connectors[3B])

### Nets
NetCN6_1: D9.1(~_1) RN5.1 ; port RAIL_INPUT_9
NetCN6_2: D10.1(~_1) RN5.3 ; port RAIL_INPUT_10
NetCN6_3: D11.1(~_1) RN5.5 ; port RAIL_INPUT_11
NetCN6_4: D12.1(~_1) RN5.7 ; port RAIL_INPUT_12
NetCN6_5: D13.1(~_1) RN6.1 ; port RAIL_INPUT_13
NetCN6_6: D14.1(~_1) RN6.3 ; port RAIL_INPUT_14
NetCN6_7: D15.1(~_1) RN6.5 ; port RAIL_INPUT_15
NetCN6_8: D16.1(~_1) RN6.7 ; port RAIL_INPUT_16
NetCN7_1: D9.2(~_2) D10.2(~_2) D11.2(~_2) D12.2(~_2) D13.2(~_2) D14.2(~_2) D15.2(~_2) D16.2(~_2) IC8.2(CAT/AN_1) IC8.4(CAT/AN_2) IC8.6(CAT/AN_3) IC8.8(CAT/AN_4) IC9.2(CAT/AN_1) IC9.4(CAT/AN_2) IC9.6(CAT/AN_3) IC9.8(CAT/AN_4) ; port DCC_CENTRAL
NetD9_3: D9.3(+) D9.4(-)
NetD10_3: D10.3(+) D10.4(-)
NetD11_3: D11.3(+) D11.4(-)
NetD12_3: D12.3(+) D12.4(-)
NetD13_3: D13.3(+) D13.4(-)
NetD14_3: D14.3(+) D14.4(-)
NetD15_3: D15.3(+) D15.4(-)
NetD16_3: D16.3(+) D16.4(-)
NetIC8_1: IC8.1(AN/CAT_1) RN5.2
NetIC8_3: IC8.3(AN/CAT_2) RN5.4
NetIC8_5: IC8.5(AN/CAT_3) RN5.6
NetIC8_7: IC8.7(AN/CAT_4) RN5.8
NetIC9_1: IC9.1(AN/CAT_1) RN6.2
NetIC9_3: IC9.3(AN/CAT_2) RN6.4
NetIC9_5: IC9.5(AN/CAT_3) RN6.6
NetIC9_7: IC9.7(AN/CAT_4) RN6.8

### Library data of the parts
D9-D16 = B140C1000DIP_DB101: as D1 on sheet Current_Detection_1_8; Datasheet Link: http://www.rectron.com/data_sheets/db101-107.pdf; Height: 4.9mm; Mouser Part Number: 583-DB101; Mouser Price/Stock: https://www.mouser.co.uk/ProductDetail/Rectron/DB101?qs=G5AQjGfRJcKGSaxDP6qXzQ%3D%3D
IC8 IC9 = LTV-844: as IC6 on sheet Inverter; Datasheet Link: https://componentsearchengine.com/Datasheets/1/LTV-844.pdf; Height: 4.5mm; Manufacturer_Part_Number: LTV-844; Mouser Part Number: 859-LTV-844; Mouser Price/Stock: https://www.mouser.co.uk/ProductDetail/Lite-On/LTV-844?qs=BZ0sscl82p8P4kyBjSwzAg%3D%3D; Arrow Part Number: LTV-844; Arrow Price/Stock: https://www.arrow.com/en/products/ltv-844/lite-on-technology?region=nac
RN5 RN6 = SIL 8-4 22: as RN3 on sheet Current_Detection_1_8; Datasheet Link: http://www.bourns.com/pdfs/4600X.pdf; Height: 5.08mm; Mouser Part Number: 652-4608X-2LF-1K; Mouser Price/Stock: https://www.mouser.co.uk/ProductDetail/Bourns/4608X-102-102LF?qs=EFWIAreJVABaVln%252BuPVHjA%3D%3D; Arrow Part Number: 4608X-102-102LF; Arrow Price/Stock: https://www.arrow.com/en/products/4608x-102-102lf/bourns?region=europe

## Nets that join several sheets
GND: Databus (6 pins), Shiftregister (IC1.8 IC2.8), Inverter (35 pins)
VCC: Databus (5 pins), Shiftregister (IC1.16 IC2.16), Inverter (5 pins)
NetCN1_2: Databus (CN1.2 CN2.1), Shiftregister (IC2.3)
NetCN1_4: Databus (CN1.4 CN2.3 CN3.4 CN4.3), Shiftregister (IC1.10 IC2.10)
NetCN1_6: Databus (CN1.6 CN2.4 CN3.6 CN4.4), Shiftregister (IC1.9 IC2.9)
NetCN3_2: Databus (CN3.2 CN4.1 R1.1), Shiftregister (IC1.11)
NetCN5_1: Current_Detection_Connectors (CN5.1), Current_Detection_1_8 (D1.1 RN3.1)
NetCN5_2: Current_Detection_Connectors (CN5.2), Current_Detection_1_8 (D2.1 RN3.3)
NetCN5_3: Current_Detection_Connectors (CN5.3), Current_Detection_1_8 (D3.1 RN3.5)
NetCN5_4: Current_Detection_Connectors (CN5.4), Current_Detection_1_8 (D4.1 RN3.7)
NetCN5_5: Current_Detection_Connectors (CN5.5), Current_Detection_1_8 (D5.1 RN4.1)
NetCN5_6: Current_Detection_Connectors (CN5.6), Current_Detection_1_8 (D6.1 RN4.3)
NetCN5_7: Current_Detection_Connectors (CN5.7), Current_Detection_1_8 (D7.1 RN4.5)
NetCN5_8: Current_Detection_Connectors (CN5.8), Current_Detection_1_8 (D8.1 RN4.7)
NetCN6_1: Current_Detection_Connectors (CN6.1), Current_Detection_9_16 (D9.1 RN5.1)
NetCN6_2: Current_Detection_Connectors (CN6.2), Current_Detection_9_16 (D10.1 RN5.3)
NetCN6_3: Current_Detection_Connectors (CN6.3), Current_Detection_9_16 (D11.1 RN5.5)
NetCN6_4: Current_Detection_Connectors (CN6.4), Current_Detection_9_16 (D12.1 RN5.7)
NetCN6_5: Current_Detection_Connectors (CN6.5), Current_Detection_9_16 (D13.1 RN6.1)
NetCN6_6: Current_Detection_Connectors (CN6.6), Current_Detection_9_16 (D14.1 RN6.3)
NetCN6_7: Current_Detection_Connectors (CN6.7), Current_Detection_9_16 (D15.1 RN6.5)
NetCN6_8: Current_Detection_Connectors (CN6.8), Current_Detection_9_16 (D16.1 RN6.7)
NetCN7_1: Current_Detection_Connectors (CN7.1 CN7.2), Current_Detection_1_8 (16 pins), Current_Detection_9_16 (16 pins)
NetIC1_1: Shiftregister (IC1.1), Inverter (IC4.6)
NetIC1_4: Shiftregister (IC1.4), Inverter (IC5.2)
NetIC1_5: Shiftregister (IC1.5), Inverter (IC5.4)
NetIC1_6: Shiftregister (IC1.6), Inverter (IC5.6)
NetIC1_7: Shiftregister (IC1.7), Inverter (IC5.8)
NetIC1_13: Shiftregister (IC1.13), Inverter (IC4.12)
NetIC1_14: Shiftregister (IC1.14), Inverter (IC4.10)
NetIC1_15: Shiftregister (IC1.15), Inverter (IC4.8)
NetIC2_1: Shiftregister (IC2.1), Inverter (IC3.2)
NetIC2_4: Shiftregister (IC2.4), Inverter (IC3.10)
NetIC2_5: Shiftregister (IC2.5), Inverter (IC3.12)
NetIC2_6: Shiftregister (IC2.6), Inverter (IC4.2)
NetIC2_7: Shiftregister (IC2.7), Inverter (IC4.4)
NetIC2_13: Shiftregister (IC2.13), Inverter (IC3.8)
NetIC2_14: Shiftregister (IC2.14), Inverter (IC3.6)
NetIC2_15: Shiftregister (IC2.15), Inverter (IC3.4)